# Altium schematic sheet FixBoard.SchDoc
size A3; SheetNumber: 1; SheetTotal: 1
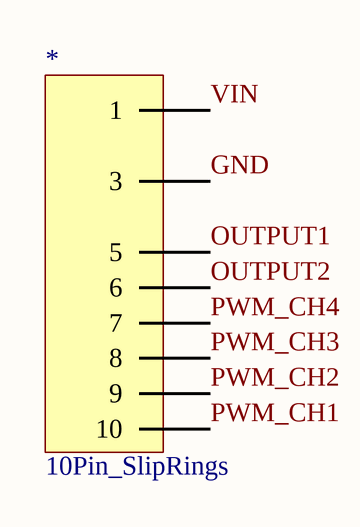
[diagram p0: FixBoard.SchDoc]

## Parts
*  10Pin_SlipRings  [10Pin_SlipRings]

## Nets
GND: *.3
OUTPUT1: *.5
OUTPUT2: *.6
PWM_CH1: *.10
PWM_CH2: *.9
PWM_CH3: *.8
PWM_CH4: *.7
VIN: *.1